# EAGLE design shield (EAGLE 4.16)
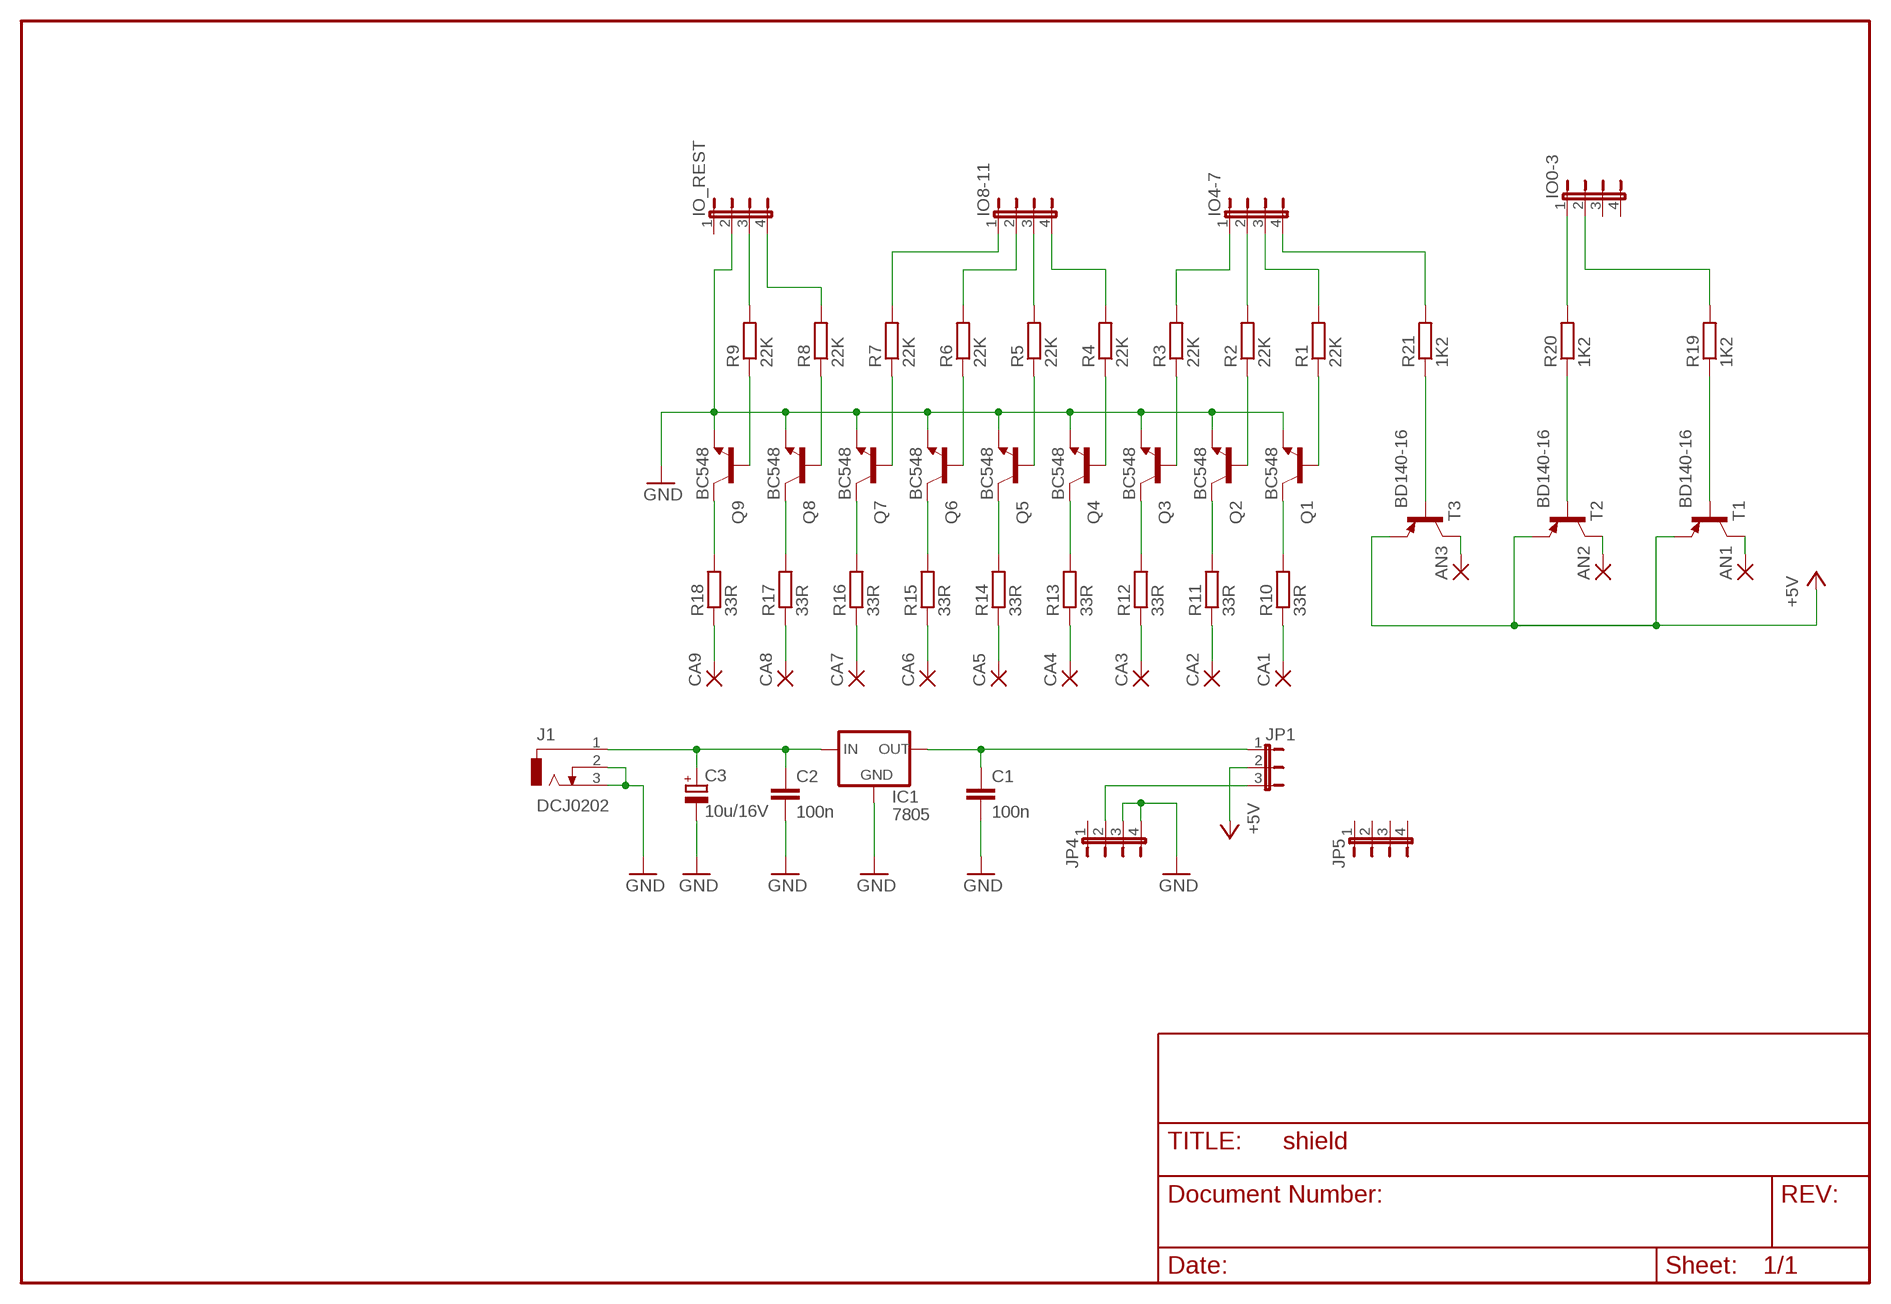
[diagram p0: schematic, sheet 1]

## Parts
AN1  1,6/0,8  [1,6/0,8]
AN2  1,6/0,8  [1,6/0,8]
AN3  1,6/0,8  [1,6/0,8]
C1  100n  C-EU025-024X044  [C025-024X044]
C2  100n  C-EU025-024X044  [C025-024X044]
C3  10u/16V  CPOL-EUE15-5AXIAL  [E15-5]
CA1  1,6/0,8  [1,6/0,8]
CA2  1,6/0,8  [1,6/0,8]
CA3  1,6/0,8  [1,6/0,8]
CA4  1,6/0,8  [1,6/0,8]
CA5  1,6/0,8  [1,6/0,8]
CA6  1,6/0,8  [1,6/0,8]
CA7  1,6/0,8  [1,6/0,8]
CA8  1,6/0,8  [1,6/0,8]
CA9  1,6/0,8  [1,6/0,8]
IC1  7805  78XXL  [78XXL]
IO0-3  JP4E  [JP4]
IO4-7  JP4E  [JP4]
IO8-11  JP4E  [JP4]
IO_REST  JP4E  [JP4]
J1  DCJ0202  [DCJ0202]
JP1  JP2E  [JP2]
JP4  JP4E  [JP4]
JP5  JP4E  [JP4]
Q1  BC548  [TO92-EBC]
Q2  BC548  [TO92-EBC]
Q3  BC548  [TO92-EBC]
Q4  BC548  [TO92-EBC]
Q5  BC548  [TO92-EBC]
Q6  BC548  [TO92-EBC]
Q7  BC548  [TO92-EBC]
Q8  BC548  [TO92-EBC]
Q9  BC548  [TO92-EBC]
R1  22K  R-EU_0204/7  [0204/7]
R2  22K  R-EU_0204/7  [0204/7]
R3  22K  R-EU_0204/7  [0204/7]
R4  22K  R-EU_0204/7  [0204/7]
R5  22K  R-EU_0204/7  [0204/7]
R6  22K  R-EU_0204/7  [0204/7]
R7  22K  R-EU_0204/7  [0204/7]
R8  22K  R-EU_0204/7  [0204/7]
R9  22K  R-EU_0204/7  [0204/7]
R10  33R  R-EU_0204/7  [0204/7]
R11  33R  R-EU_0204/7  [0204/7]
R12  33R  R-EU_0204/7  [0204/7]
R13  33R  R-EU_0204/7  [0204/7]
R14  33R  R-EU_0204/7  [0204/7]
R15  33R  R-EU_0204/7  [0204/7]
R16  33R  R-EU_0204/7  [0204/7]
R17  33R  R-EU_0204/7  [0204/7]
R18  33R  R-EU_0204/7  [0204/7]
R19  1K2  R-EU_0204/7  [0204/7]
R20  1K2  R-EU_0204/7  [0204/7]
R21  1K2  R-EU_0204/7  [0204/7]
T1  BD140-16  -PNP-TO126V  [TO126V]
T2  BD140-16  -PNP-TO126V  [TO126V]
T3  BD140-16  -PNP-TO126V  [TO126V]

## Nets
+5V: JP1.2 T1.1(E) T2.1(E) T3.1(E)
GND: C1.2 C2.2 C3.- IC1.GND IO_REST.2 J1.2 J1.3 JP4.3 JP4.4 Q1.E Q2.E Q3.E Q4.E Q5.E Q6.E Q7.E Q8.E Q9.E
N$1: Q1.C R10.2
N$2: Q2.C R11.2
N$3: Q3.C R12.2
N$4: Q4.C R13.2
N$5: Q5.C R14.2
N$6: Q6.C R15.2
N$7: Q7.C R16.2
N$8: Q8.C R17.2
N$9: IO0-3.2 R19.2
N$10: IO0-3.1 R20.2
N$11: IO4-7.4 R21.2
N$12: Q9.C R18.2
N$13: R19.1 T1.3(B)
N$14: R20.1 T2.3(B)
N$15: R21.1 T3.3(B)
N$16: JP1.3 JP4.2
N$17: Q1.B R1.1
N$18: IO4-7.2 R2.2
N$19: IO8-11.3 R5.2
N$20: IO_REST.3 R9.2
N$22: Q9.B R9.1
N$23: Q8.B R8.1
N$24: Q7.B R7.1
N$25: Q6.B R6.1
N$26: AN3.1(P) T3.2(C)
N$27: AN2.1(P) T2.2(C)
N$28: AN1.1(P) T1.2(C)
N$29: CA1.1(P) R10.1
N$30: CA2.1(P) R11.1
N$31: CA3.1(P) R12.1
N$32: CA5.1(P) R14.1
N$33: CA6.1(P) R15.1
N$34: CA7.1(P) R16.1
N$35: CA8.1(P) R17.1
N$36: CA9.1(P) R18.1
N$37: IO4-7.3 R1.2
N$38: Q5.B R5.1
N$39: IO4-7.1 R3.2
N$40: IO8-11.4 R4.2
N$41: Q4.B R4.1
N$42: IO8-11.2 R6.2
N$43: IO8-11.1 R7.2
N$44: Q3.B R3.1
N$45: IO_REST.4 R8.2
N$46: Q2.B R2.1
N$47: CA4.1(P) R13.1
N$48: C2.1 C3.+ IC1.IN J1.1
N$49: C1.1 IC1.OUT JP1.1
Unconnected: IO0-3.3 IO0-3.4 IO_REST.1 JP4.1 JP5.1 JP5.2 JP5.3 JP5.4

## Library data of the parts
AN1-AN3 CA1-CA9 = wirepad:1,6/0,8: THROUGH-HOLE PAD
C1 C2 = rcl:C-EU: CAPACITOR, European symbol
C3 = rcl:CPOL-EU: POLARIZED CAPACITOR, European symbol
IC1 = v-reg:78XXL: VOLTAGE REGULATOR
IO0-3 IO4-7 IO8-11 IO_REST JP4 JP5 = jumper:JP4E: JUMPER
J1 = con-jack:DCJ0202: DC POWER JACK Source: DCJ0202.pdf
JP1 = jumper:JP2E: JUMPER
Q1-Q9 = transistor-npn:BC548*: NPN Transistor
R1-R21 = rcl:R-EU_: RESISTOR, European symbol
T1-T3 = transistor:*-PNP-: PNP Transistror

## Board
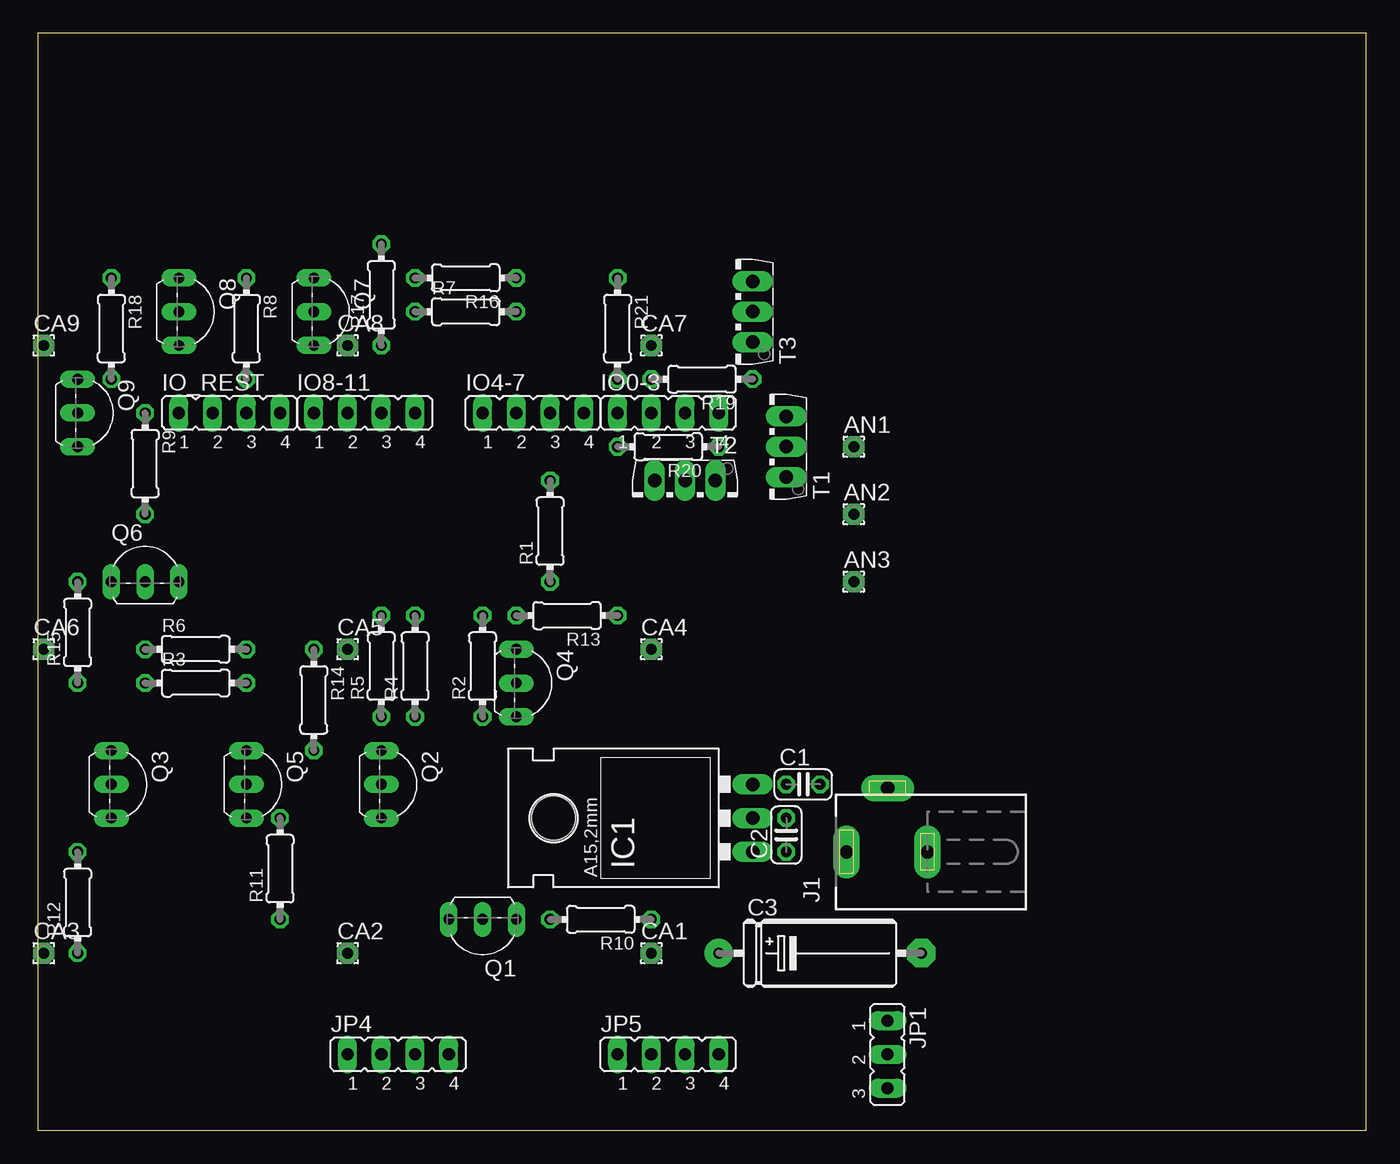
[diagram p1: board, top side]
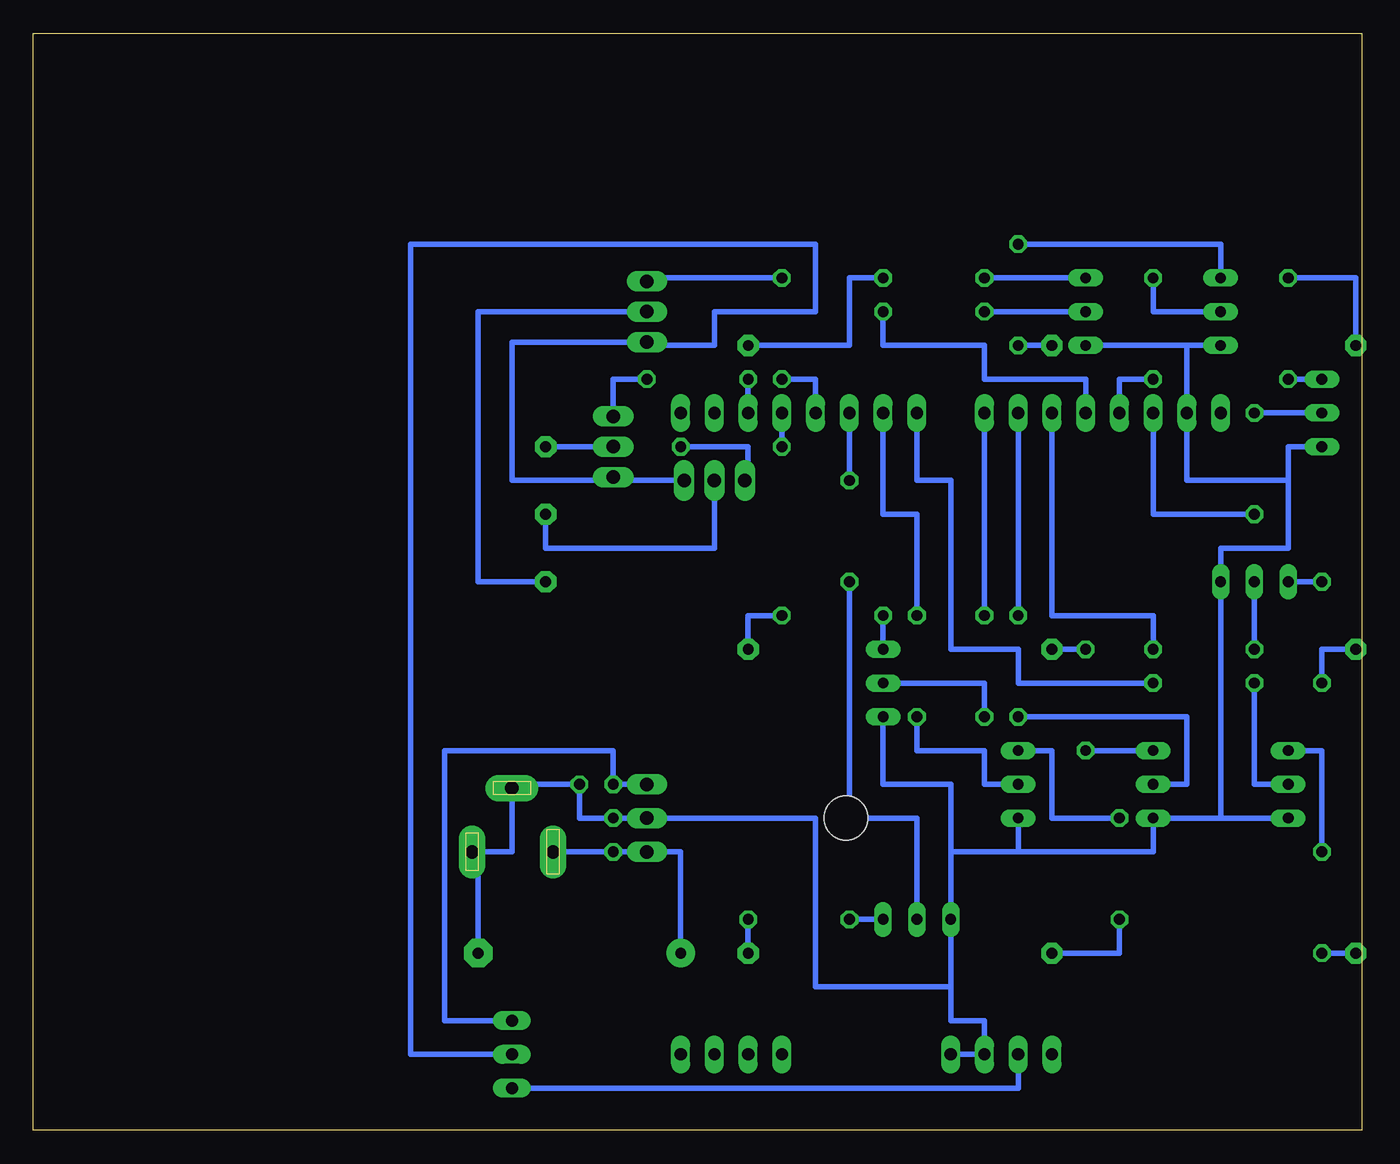
[diagram p2: board, bottom side, seen from below]

Size 100 x 82.54 mm. Coordinates in mm from the lower left corner, seen from the top.
Outline: 0,0 100,0 100,82.54 0,82.54 0,0
Copper layers 1: Top 0.035mm
Design rules "default": minimum track width 10mil, minimum drill 24mil, track to track 8mil, track to pad 8mil, pad to pad 8mil, via to via 8mil, smd to smd 8mil, copper to edge 40mil, drill to drill 8mil, minimum pad ring 10mil, minimum via ring 8mil, stop-mask expansion 4mil, vias tented up to drill 0mil, thermal gap 10mil

### Footprints (pad centres in the part's own frame; a part is rotated, then mirrored left to right if it is on the bottom)
1,6/0,8 = drill 0.813 pad 1.6 octagon: 1 0,0
C025-024X044 = drill 0.813 octagon: 1 -1.27,0; 2 1.27,0
E15-5 = drill 0.813 pad 2.159 round: + -7.62,0 | drill 0.813 pad 2.159 octagon: - 7.62,0
78XXL = drill 1.016 long: GND 0,-3.81; IN -2.54,-3.81; OUT 2.54,-3.81 | hole 3.302: 0,11.176
JP4 = drill 0.914 long: 1 -3.81,0; 2 -1.27,0; 3 1.27,0; 4 3.81,0
DCJ0202 = drill 1 pad 2 long: 1 0,3.1; 2 4.8,0; 3 0,-3
JP2 = drill 0.914 long: 1 -2.54,0; 2 0,0; 3 2.54,0
TO92-EBC = drill 0.813 long: B 0,-1.27; C -2.54,-1.27; E 2.54,-1.27
0204/7 = drill 0.813 octagon: 1 -3.81,0; 2 3.81,0
TO126V = drill 1.016 long: 1 -2.286,-1.27; 2 0,-1.27; 3 2.286,-1.27

### Placement (x,y rotation side)
AN1  61.43,51.43 0 top
AN2  61.43,46.35 0 top
AN3  61.43,41.27 0 top
C1  57.62,26.03 0 top
C2  56.35,22.22 90 top
C3  58.89,13.33 0 top
CA1  46.19,13.33 0 top
CA2  23.33,13.33 0 top
CA3  0.47,13.33 0 top
CA4  46.19,36.19 0 top
CA5  23.33,36.19 0 top
CA6  0.47,36.19 0 top
CA7  46.19,59.05 0 top
CA8  23.33,59.05 0 top
CA9  0.47,59.05 0 top
IC1  50,23.49 90 top
IO0-3  47.46,53.97 0 top
IO4-7  37.3,53.97 0 top
IO8-11  24.6,53.97 0 top
IO_REST  14.44,53.97 0 top
J1  63.97,20.95 90 top
JP1  63.97,5.71 270 top
JP4  27.14,5.71 0 top
JP5  47.46,5.71 0 top
Q1  33.49,14.6 180 top
Q2  27.14,26.03 270 top
Q3  6.82,26.03 270 top
Q4  37.3,33.65 270 top
Q5  16.98,26.03 270 top
Q6  8.09,42.54 0 top
Q7  22.06,61.59 270 top
Q8  11.9,61.59 270 top
Q9  4.28,53.97 270 top
R1  38.57,45.08 90 top
R2  33.49,34.92 90 top
R3  11.9,33.65 0 top
R4  28.41,34.92 90 top
R5  25.87,34.92 90 top
R6  11.9,36.19 0 top
R7  32.22,61.59 0 top
R8  15.71,60.32 270 top
R9  8.09,50.16 270 top
R10  42.38,15.87 180 top
R11  18.25,19.68 90 top
R12  3.01,17.14 90 top
R13  39.84,38.73 180 top
R14  20.79,32.38 270 top
R15  3.01,37.46 90 top
R16  32.22,64.13 180 top
R17  25.87,62.86 90 top
R18  5.55,60.32 270 top
R19  50,56.51 180 top
R20  47.46,51.43 180 top
R21  43.65,60.32 270 top
T1  55.08,51.43 90 top
T2  48.73,47.62 180 top
T3  52.54,61.59 90 top

### Tracks (layer width: path | path; a pad name or v marks a point on that pad's centre or on a via)
+5V
  Bottom 0.406: 56.35,48.89 T2.1 | 56.35,48.89 T1.1 | 56.35,48.89 63.97,48.89 63.97,59.3 T3.1 53.81,59.05 48.73,59.05 48.73,61.59 41.11,61.59 41.11,66.67 71.59,66.67 71.59,5.71 JP1.2
GND
  Bottom 0.406: 66.51,20.95 63.97,20.95 J1.2 63.97,26.03 C1.2 58.89,23.49 C2.2 IC1.GND 41.11,23.49 41.11,10.79 30.95,10.79 | 66.51,20.95 J1.3 | 66.51,20.95 C3.- | 5.55,48.89 5.55,51.43 Q9.E | Q3.E 10.63,23.49 | 10.63,23.49 Q6.E 10.63,43.81 5.55,43.81 5.55,48.89 | 5.55,48.89 13.17,48.89 IO_REST.2 13.17,59.05 | 10.63,23.49 Q5.E 15.71,20.95 25.87,20.95 | 13.17,59.05 Q8.E | 13.17,59.05 Q7.E | 25.87,20.95 Q2.E | 25.87,20.95 30.95,20.95 | 30.95,20.95 30.95,26.03 36.03,26.03 Q4.E | 30.95,20.95 Q1.E 30.95,10.79 | 30.95,10.79 30.95,8.25 28.41,8.25 JP4.3 JP4.4
N$1
  Bottom 0.406: Q1.C R10.2
N$2
  Bottom 0.406: R11.2 23.33,23.49 23.33,28.57 Q2.C
N$3
  Bottom 0.406: R12.2 3.01,28.57 Q3.C
N$4
  Bottom 0.406: Q4.C R13.2
N$5
  Bottom 0.406: Q5.C R14.2
N$6
  Bottom 0.406: R15.2 Q6.C
N$7
  Bottom 0.406: Q7.C R16.2
N$8
  Bottom 0.406: Q8.C 10.63,66.67 R17.2
N$9
  Bottom 0.406: IO0-3.2 R19.2
N$10
  Bottom 0.406: R20.2 IO0-3.1
N$11
  Bottom 0.406: IO4-7.4 41.11,56.51 R21.2
N$12
  Bottom 0.406: Q9.C R18.2
N$13
  Bottom 0.406: T1.3 56.35,56.51 R19.1
N$14
  Bottom 0.406: T2.3 46.19,48.89 46.19,51.43 R20.1
N$15
  Bottom 0.406: R21.1 53.81,64.13 T3.3
N$16
  Bottom 0.406: JP4.2 25.87,3.17 JP1.3
N$17
  Bottom 0.406: Q1.B 33.49,23.49 38.57,23.49 R1.1
N$18
  Bottom 0.406: R2.2 33.49,46.35 36.03,46.35 IO4-7.2
N$19
  Bottom 0.406: R5.2 IO8-11.3
N$20
  Bottom 0.406: R9.2 15.71,46.35 IO_REST.3
N$22
  Bottom 0.406: Q9.B R9.1
N$23
  Bottom 0.406: Q8.B 15.71,61.59 R8.1
N$24
  Bottom 0.406: Q7.B R7.1
N$25
  Bottom 0.406: R6.1 Q6.B
N$26
  Bottom 0.406: T3.2 66.51,61.59 66.51,41.27 AN3.1
N$27
  Bottom 0.406: T2.2 48.73,43.81 61.43,43.81 AN2.1
N$28
  Bottom 0.406: T1.2 AN1.1
N$29
  Bottom 0.406: CA1.1 R10.1
N$30
  Bottom 0.406: R11.1 18.25,13.33 CA2.1
N$31
  Bottom 0.406: CA3.1 R12.1
N$32
  Bottom 0.406: R14.1 CA5.1
N$33
  Bottom 0.406: CA6.1 3.01,36.19 R15.1
N$34
  Bottom 0.406: CA7.1 38.57,59.05 38.57,64.13 R16.1
N$35
  Bottom 0.406: CA8.1 R17.1
N$36
  Bottom 0.406: CA9.1 0.47,64.13 R18.1
N$37
  Bottom 0.406: R1.2 IO4-7.3
N$38
  Bottom 0.406: Q5.B 13.17,26.03 13.17,31.11 R5.1
N$39
  Bottom 0.406: R3.2 25.87,33.65 25.87,36.19 30.95,36.19 30.95,48.89 33.49,48.89 IO4-7.1
N$40
  Bottom 0.406: R4.2 IO8-11.4
N$41
  Bottom 0.406: R4.1 28.41,33.65 Q4.B
N$42
  Bottom 0.406: R6.2 15.71,38.73 23.33,38.73 IO8-11.2
N$43
  Bottom 0.406: IO8-11.1 20.79,56.51 28.41,56.51 28.41,59.05 36.03,59.05 R7.2
N$44
  Bottom 0.406: Q3.B 8.09,26.03 R3.1
N$45
  Bottom 0.406: R8.2 18.25,56.51 IO_REST.4
N$46
  Bottom 0.406: Q2.B 28.41,26.03 28.41,28.57 33.49,28.57 R2.1
N$47
  Bottom 0.406: R13.1 46.19,38.73 CA4.1
N$48
  Bottom 0.406: C3.+ 51.27,20.95 IC1.IN C2.1 J1.1
N$49
  Bottom 0.406: IC1.OUT C1.1 56.35,28.57 69.05,28.57 69.05,8.25 JP1.1